# Altium schematic sheet PCB.SchDoc
size A4
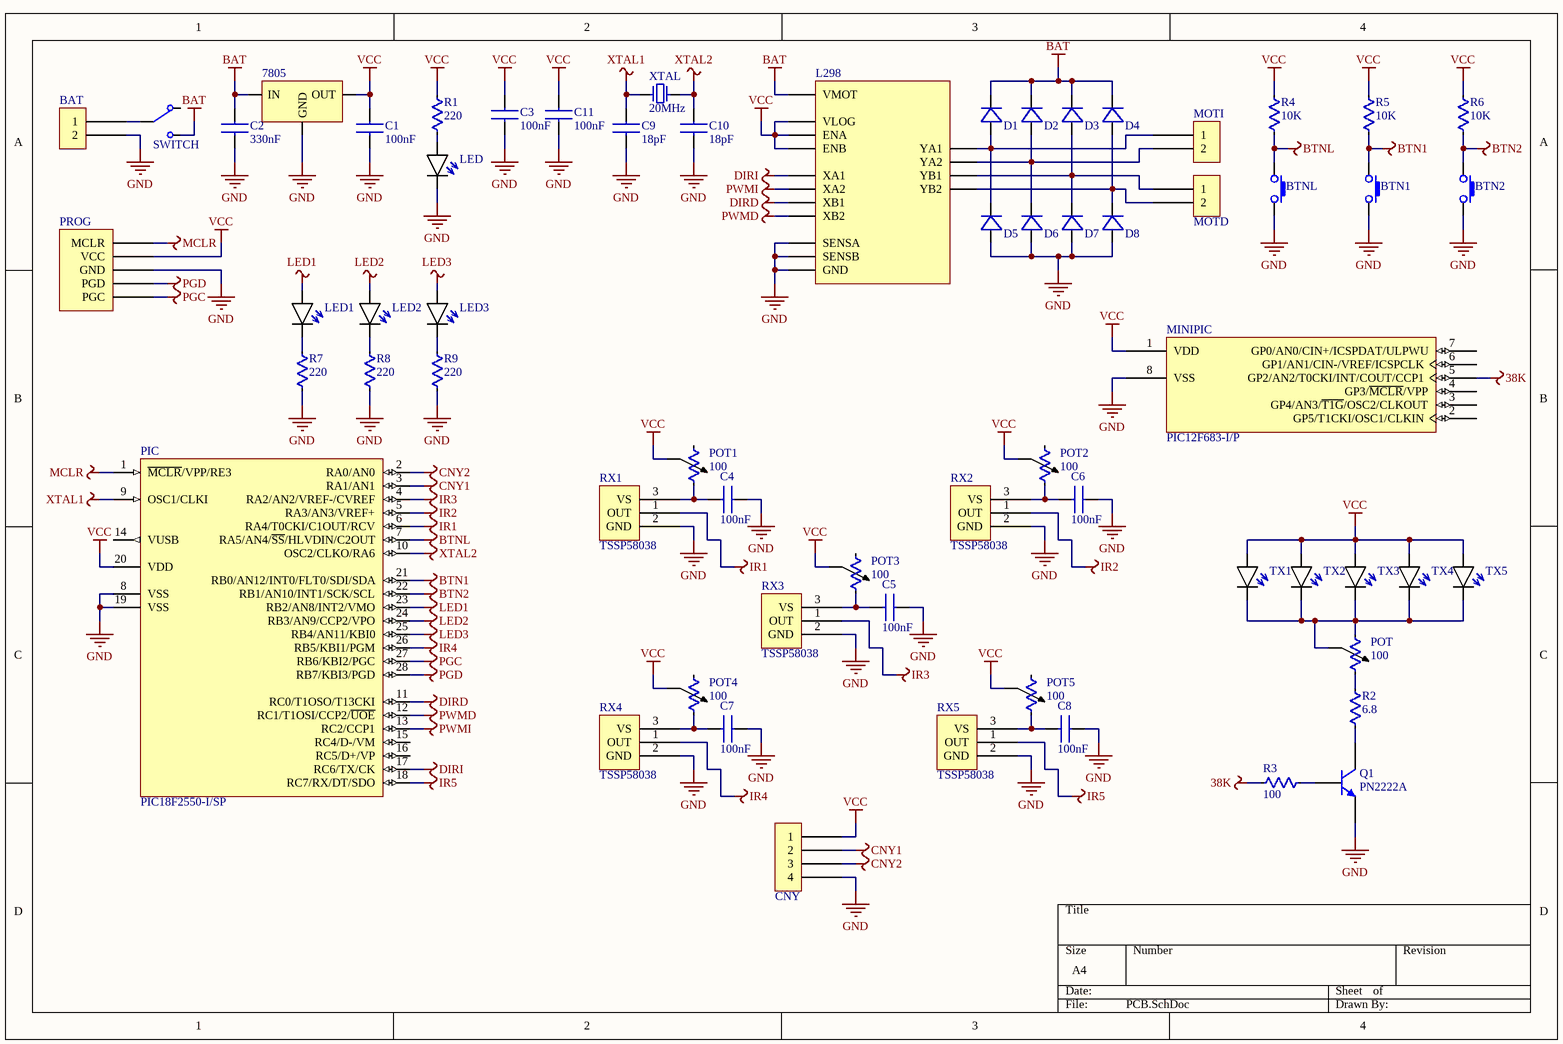
[diagram p0: PCB.SchDoc]

## Parts
7805  LM78XX  [TO-220-FLAT]  (value not drawn)
BAT  Header 1x2  [HEADER 1x2]  (value not drawn)
BTN1  BUTTON_SMALL_4PIN  [TACT_SWITCH-SMALL-4PIN]  (value not drawn)
BTN2  BUTTON_SMALL_4PIN  [TACT_SWITCH-SMALL-4PIN]  (value not drawn)
BTNL  BUTTON_SMALL_4PIN  [TACT_SWITCH-SMALL-4PIN]  (value not drawn)
C1  value 100nF  [CAP-CER]  (hidden comment: CAP-CER)
C2  value 330nF  [CAP-CER]  (hidden comment: CAP-CER)
C3  value 100nF  [CAP-CER]  (hidden comment: CAP-CER)
C4  value 100nF  [CAP-CER]  (hidden comment: CAP-CER)
C5  value 100nF  [CAP-CER]  (hidden comment: CAP-CER)
C6  value 100nF  [CAP-CER]  (hidden comment: CAP-CER)
C7  value 100nF  [CAP-CER]  (hidden comment: CAP-CER)
C8  value 100nF  [CAP-CER]  (hidden comment: CAP-CER)
C9  value 18pF  [CAP-CER]  (hidden comment: CAP-CER)
C10  value 18pF  [CAP-CER]  (hidden comment: CAP-CER)
C11  value 100nF  [CAP-CER]  (hidden comment: CAP-CER)
CNY  Header 1x4  [Header 1x4]  (value not drawn)
D1  DIODE  [DO-41 RADIAL]  (value not drawn)
D2  DIODE  [DO-41 RADIAL]  (value not drawn)
D3  DIODE  [DO-41 RADIAL]  (value not drawn)
D4  DIODE  [DO-41 RADIAL]  (value not drawn)
D5  DIODE  [DO-41 RADIAL]  (value not drawn)
D6  DIODE  [DO-41 RADIAL]  (value not drawn)
D7  DIODE  [DO-41 RADIAL]  (value not drawn)
D8  DIODE  [DO-41 RADIAL]  (value not drawn)
L298  L298  [Multiwatt15]  (value not drawn)
LED  LED  [LED-3MM-RED]  (value not drawn)
LED1  LED  [LED-3MM-RED]  (value not drawn)
LED2  LED  [LED-3MM-YELLOW]  (value not drawn)
LED3  LED  [LED-3MM-GREEN]  (value not drawn)
MINIPIC  PIC12F683-I/P  [PDIP300-P8]
MOTD  (no value)  [HEADER 1x2]
MOTI  (no value)  [HEADER 1x2]
PIC  PIC18F2550-I/SP  [SPDIP300-SP28]
POT  value 100  [POT-10TURN]  (hidden comment: POT)
POT1  value 100  [POT-10TURN]  (hidden comment: POT)
POT2  value 100  [POT-10TURN]  (hidden comment: POT)
POT3  value 100  [POT-10TURN]  (hidden comment: POT)
POT4  value 100  [POT-10TURN]  (hidden comment: POT)
POT5  value 100  [POT-10TURN]  (hidden comment: POT)
PROG  (no value)  [Header 1x5]
Q1  PN2222A  [TO-92]
R1  value 220  [RES-Axial-400mil]  (hidden comment: RES)
R2  value 6.8  [RES-Axial-400mil]  (hidden comment: RES)
R3  value 100  [RES-Axial-400mil]  (hidden comment: RES)
R4  value 10K  [RES-Axial-400mil]  (hidden comment: RES)
R5  value 10K  [RES-Axial-400mil]  (hidden comment: RES)
R6  value 10K  [RES-Axial-400mil]  (hidden comment: RES)
R7  value 220  [RES-RADIAL]  (hidden comment: RES)
R8  value 220  [RES-RADIAL]  (hidden comment: RES)
R9  value 220  [RES-RADIAL]  (hidden comment: RES)
RX1  TSSP58038  [TSSP58038]
RX2  TSSP58038  [TSSP58038]
RX3  TSSP58038  [TSSP58038]
RX4  TSSP58038  [TSSP58038]
RX5  TSSP58038  [TSSP58038]
SWITCH  SLIDE-SWITCH  [SWITCH]  (value not drawn)
TX1  LED  [LED-3MM-YELLOW]  (value not drawn)
TX2  LED  [LED-3MM-YELLOW]  (value not drawn)
TX3  LED  [LED-3MM-YELLOW]  (value not drawn)
TX4  LED  [LED-3MM-YELLOW]  (value not drawn)
TX5  LED  [LED-3MM-YELLOW]  (value not drawn)
XTAL  FREQUENCY: 20MHz  [CRYSTAL-TH]  (hidden comment: XTAL)

## Nets
38K: MINIPIC.5(GP2/AN2/T0CKI/INT/COUT/CCP1) R3.1
BAT: 7805.1(IN) C2.1 D1.K D2.K D3.K D4.K L298.4(VMOT) SWITCH.3
BTN1: BTN1.1 PIC.21(RB0/AN12/INT0/FLT0/SDI/SDA) R5.1
BTN2: BTN2.1 PIC.22(RB1/AN10/INT1/SCK/SCL) R6.1
BTNL: BTNL.1 PIC.7(RA5/AN4/~{SS}/HLVDIN/C2OUT) R4.1
CNY1: CNY.2 PIC.3(RA1/AN1)
CNY2: CNY.3 PIC.2(RA0/AN0)
DIRD: L298.12(XB1) PIC.11(RC0/T1OSO/T13CKI)
DIRI: L298.5(XA1) PIC.17(RC6/TX/CK)
GND: 7805.2(GND) BAT.2 BTN1.2 BTN2.2 BTNL.2 C1.2 C2.2 C3.1 C4.2 C5.2 C6.2 C7.2 C8.2 C9.1 C10.1 C11.1 CNY.4 D5.A D6.A D7.A D8.A L298.1(SENSA) L298.8(GND) L298.15(SENSB) LED.K MINIPIC.8(VSS) PIC.8(VSS) PIC.19(VSS) PROG.3(GND) Q1.E R7.2 R8.2 R9.2 RX1.2(GND) RX2.2(GND) RX3.2(GND) RX4.2(GND) RX5.2(GND)
IR1: PIC.6(RA4/T0CKI/C1OUT/RCV) RX1.1(OUT)
IR2: PIC.5(RA3/AN3/VREF+) RX2.1(OUT)
IR3: PIC.4(RA2/AN2/VREF-/CVREF) RX3.1(OUT)
IR4: PIC.26(RB5/KBI1/PGM) RX4.1(OUT)
IR5: PIC.18(RC7/RX/DT/SDO) RX5.1(OUT)
LED1: LED1.A PIC.23(RB2/AN8/INT2/VMO)
LED2: LED2.A PIC.24(RB3/AN9/CCP2/VPO)
LED3: LED3.A PIC.25(RB4/AN11/KBI0)
MCLR: PIC.1(~{MCLR}/VPP/RE3) PROG.1(MCLR)
PGC: PIC.27(RB6/KBI2/PGC) PROG.5(PGC)
PGD: PIC.28(RB7/KBI3/PGD) PROG.4(PGD)
PWMD: L298.10(XB2) PIC.12(RC1/T1OSI/CCP2/~{UOE})
PWMI: L298.7(XA2) PIC.13(RC2/CCP1)
VCC: 7805.3(OUT) C1.1 C3.2 C11.2 CNY.1 L298.6(ENA) L298.9(VLOG) L298.11(ENB) MINIPIC.1(VDD) PIC.20(VDD) POT1.2 POT2.2 POT3.2 POT4.2 POT5.2 PROG.2(VCC) R1.2 R4.2 R5.2 R6.2 TX1.A TX2.A TX3.A TX4.A TX5.A
XTAL1: C9.2 PIC.9(OSC1/CLKI) XTAL.1
XTAL2: C10.2 PIC.10(OSC2/CLKO/RA6) XTAL.2
NetBAT_1: BAT.1 SWITCH.2
NetC4_1: C4.1 POT1.1 RX1.3(VS)
NetC5_1: C5.1 POT3.1 RX3.3(VS)
NetC6_1: C6.1 POT2.1 RX2.3(VS)
NetC7_1: C7.1 POT4.1 RX4.3(VS)
NetC8_1: C8.1 POT5.1 RX5.3(VS)
NetD1_A: D1.A D5.K L298.2(YA1) MOTI.1
NetD2_A: D2.A D6.K L298.3(YA2) MOTI.2
NetD3_A: D3.A D7.K L298.13(YB1) MOTD.1
NetD4_A: D4.A D8.K L298.14(YB2) MOTD.2
NetLED1_K: LED1.K R7.1
NetLED2_K: LED2.K R8.1
NetLED3_K: LED3.K R9.1
NetLED_A: LED.A R1.1
NetPOT_1: POT.1 R2.1
NetPOT_2: POT.2 POT.3 TX1.K TX2.K TX3.K TX4.K TX5.K
NetQ1_B: Q1.B R3.2
NetQ1_C: Q1.C R2.2

Not connected (* = marked no-connect by the designer): MINIPIC 2(GP5/T1CKI/OSC1/CLKIN) 3(GP4/AN3/~{T1G}/OSC2/CLKOUT) 4(GP3/~{MCLR}/VPP) 6(GP1/AN1/CIN-/VREF/ICSPCLK) 7(GP0/AN0/CIN+/ICSPDAT/ULPWU); PIC 14(VUSB) 15(RC4/D-/VM) 16(RC5/D+/VP); POT1 3; POT2 3; POT3 3; POT4 3; POT5 3; SWITCH 1

## Library data of the parts
D1-D8 = DIODE: NAME: 1N4007
MINIPIC = PIC12F683-I/P: Flash-Based 8-Bit CMOS Microcontroller with nanoWatt Technology, 2K (x14-Bit words) Program Memory, 384 Bytes Data Memory, 8-Pin PDIP, Industrial Temperature; Published: 29-Jan-2009; LatestRevisionDate: 02-Dec-2009; LatestRevisionNote: Updated to datasheet revision revD, Feb-2007.; DatasheetVersion: revD, Feb-2007; PackageVersion: revBB, Aug-2009; PackageReference: PDIP300-P8; Publisher: Altium Limited; PackageDescription: 8-Lead Plastic Dual In-Line (P) - 300 mil Body [PDIP]; Supplier 1: Digi-Key; Supplier Part Number 1: PIC12F683-I/P-ND; Supplier 2: Farnell; Supplier Part Number 2: 9759034; Supplier 3: Farnell; Supplier Part Number 3: 1523923; Code_JEDEC: MS-001; ComponentLink1Description: Datasheet; ComponentLink1URL: http://ww1.microchip.com/downloads/en/DeviceDoc/41211D_.pdf; ComponentLink2Description: Packaging Specification; ComponentLink2URL: http://www.microchip.com/stellent/groups/techpub_sg/documents/packagingspec/en012702.pdf; ComponentLink3Description: Microchip.com Home; ComponentLink3URL: http://www.microchip.com/
MOTD MOTI = Header 1x2
PIC = PIC18F2550-I/SP: High Performance, Enhanced Flash, USB Microcontroller with nanoWatt Technology, 32K Flash, 28-Pin SPDIP, Industrial Temperature Range; Published: 29-Jan-2009; LatestRevisionDate: 02-Dec-2009; LatestRevisionNote: Updated to datasheet revision E, Aug-2008; DatasheetVersion: revE, Aug-2008; PackageVersion: revBB, Aug-2009; PackageReference: SPDIP300-SP28; Publisher: Altium Limited; PackageDescription: 28-Lead Skinny Plastic Dual In-Line (SP) - 300 mil Body [SPDIP]; Supplier 1: Digi-Key; Supplier Part Number 1: PIC18F2550-I/SP-ND; Supplier 2: Farnell; Supplier Part Number 2: 9321250; Supplier 3: Farnell; Supplier Part Number 3: 1523822; ComponentLink1Description: Datasheet; ComponentLink1URL: http://ww1.microchip.com/downloads/en/DeviceDoc/39632e.pdf; ComponentLink2Description: Packaging Specification; ComponentLink2URL: http://www.microchip.com/stellent/groups/techpub_sg/documents/packagingspec/en012702.pdf; ComponentLink3Description: Microchip.com Home; ComponentLink3URL: http://www.microchip.com/
PROG = Header Programmer
Q1 = NPN